# Altium schematic sheet VermogensPrint.SchDoc
size A4; SheetNumber: 1; SheetTotal: 1
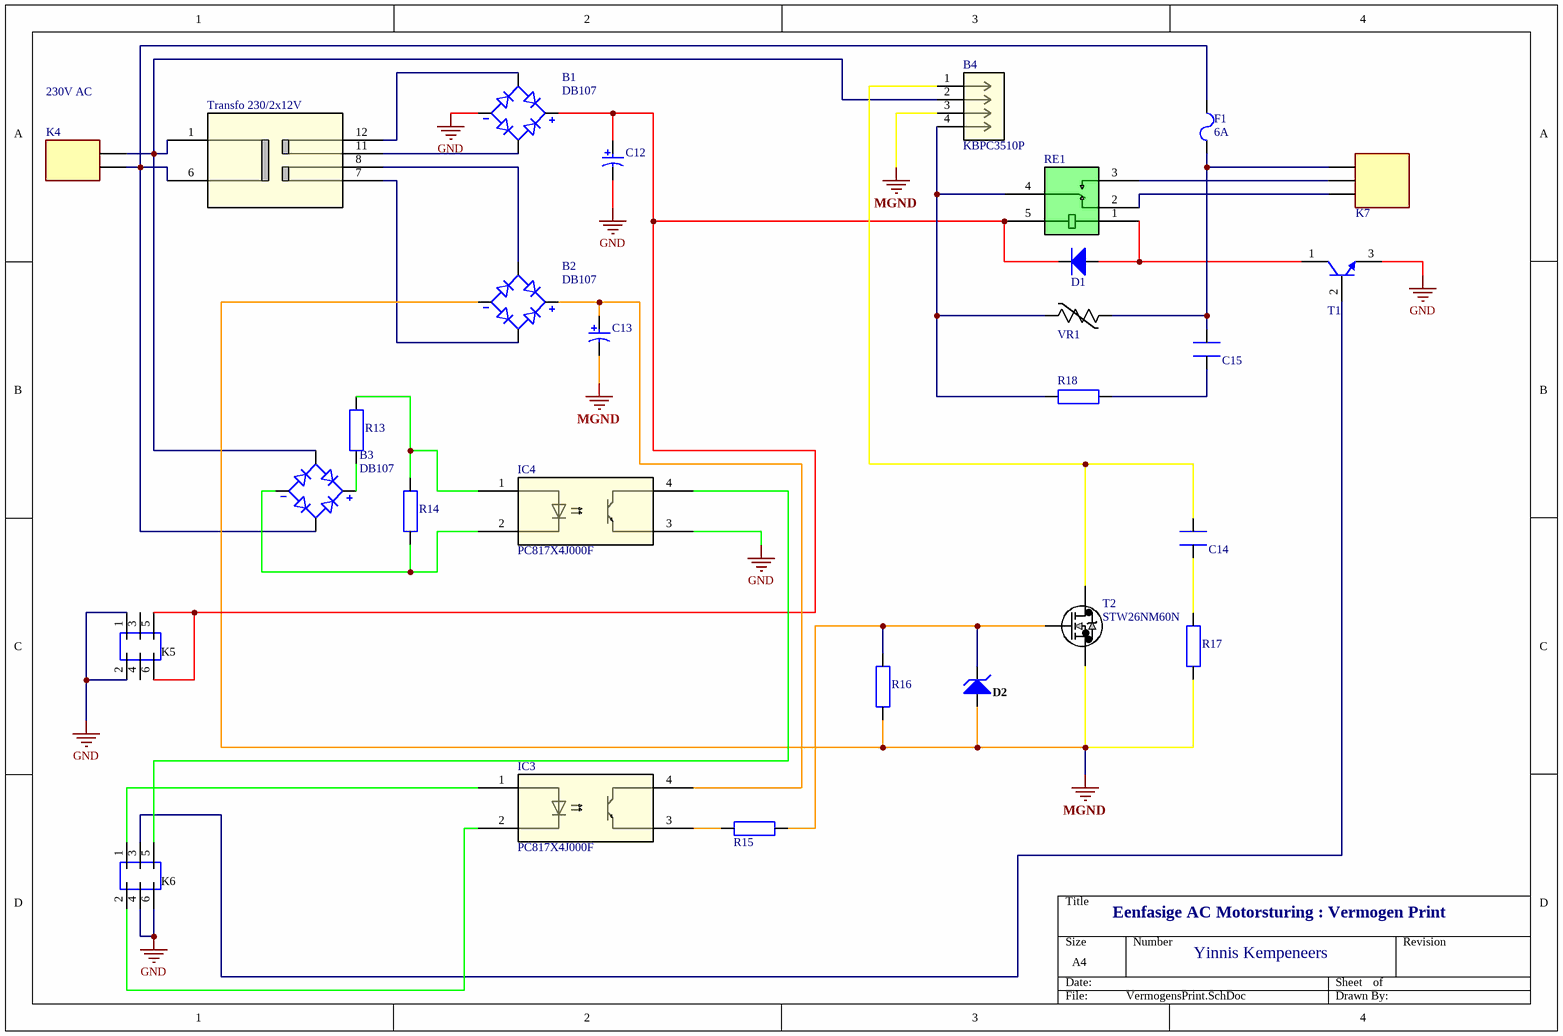
[diagram p0: VermogensPrint.SchDoc]

## Parts
B1  DB107  [DB107]
B2  DB107  [DB107]
B3  DB107  [DB107]
B4  KBPC3510P  [KBPC3510]
C12  470µF  [Capacitor]  (value not drawn)
C13  470µF  [Capacitor]  (value not drawn)
C14  Capacitor 0.22µF 630V  [0.22µF]  (value not drawn)
C15  0.22µF  [0.22µF]  (value not drawn)
D1  1N4007-T  [1N4007-T]  (value not drawn)
D2  1N4742A  [1N4742A]  (value not drawn)
F1  6A  [FUSE]
IC3  PC817X4J000F  [PC817X4J000F]
IC4  PC817X4J000F  [PC817X4J000F]
K4  (no value)  [2-Polige Connector]
K5  TSW-103-08-L-D  [Pin3x2]  (value not drawn)
K6  TSW-103-08-L-D  [Pin3x2]  (value not drawn)
K7  3-Polige Connetor  [3-Polige Connector]  (value not drawn)
R13  47K 3W  [47K 3W]  (value not drawn)
R14  10K 2W  [Resistor]  (value not drawn)
R15  1K  [Resistor]  (value not drawn)
R16  10K  [Resistor]  (value not drawn)
R17  2K2 2W  [2K2 2W]  (value not drawn)
R18  560E 5W  [560Ohm 5W]  (value not drawn)
RE1  G2R-14 DC12  [RELAY_G2R-14_OMR]  (value not drawn)
T1  BC547B  [Transistor]  (value not drawn)
T2  STW26NM60N  [TO-247_STM]
Transfo_230/2x12V  T1  [T1]  (value not drawn)
VR1  V25S275P  [VRES_V25S385P_LTF]  (value not drawn)

## Nets
GND: B1.2(NEG) C12.2 IC4.3 K5.1 K5.2 K6.4 K6.6 T1.3(E)
MGND: B2.2(NEG) B4.3 C13.2 D2.1(A) R16.1 R17.1 T2.3
NetB1_1: B1.1(POS) C12.1 D1.2(K) K5.5 K5.6 RE1.5
NetB1_3: B1.3(AC1) Transfo_230/2x12V.11
NetB1_4: B1.4(AC2) Transfo_230/2x12V.12
NetB2_1: B2.1(POS) C13.1 IC3.4
NetB2_3: B2.3(AC1) Transfo_230/2x12V.7
NetB2_4: B2.4(AC2) Transfo_230/2x12V.8
NetB3_1: B3.1(POS) R13.2
NetB3_2: B3.2(NEG) IC4.2 R14.1
NetB3_3: B3.3(AC1) F1.2 K4.1 Transfo_230/2x12V.6
NetB3_4: B3.4(AC2) B4.2 K4.2 Transfo_230/2x12V.1
NetB4_1: B4.1 C14.1 T2.2
NetB4_4: B4.4 R18.1 RE1.4 VR1.2
NetC14_2: C14.2 R17.2
NetC15_1: C15.1 F1.1 K7.1 VR1.1
NetC15_2: C15.2 R18.2
NetD1_1: D1.1(A) RE1.1 T1.1(C)
NetD2_2: D2.2(K) R15.2 R16.2 T2.1
NetIC3_1: IC3.1 K6.1
NetIC3_2: IC3.2 K6.2
NetIC3_3: IC3.3 R15.1
NetIC4_1: IC4.1 R13.1 R14.2
NetIC4_4: IC4.4 K6.5
NetK6_3: K6.3 T1.2(B)
NetK7_2: K7.2 RE1.3
NetK7_3: K7.3 RE1.2

Not connected (* = marked no-connect by the designer): K5 3 4

## Notes on the sheet
- 230V AC
- Eenfasige AC Motorsturing : Vermogen Print
- Yinnis Kempeneers

## Library data of the parts
B4 = KBPC3510P: No Description Available; Mfr_Name: Solid State Manufacturing; RefDes: RefDes; Type: Type
C12 C13 = 470µF: Capacitor 470µF 50V
C15 = Capacitor 0.22µF 630V
D1 = 1N4007-T: 1.0 A Rectifier, 8 pF, 1000 V, -65 to 150 degC, 2-Pin DO-41 Plastic, RoHS, Tape and Reel; Manufacturer: Diodes Inc; Max. Average Rectified Current IO (A): 1; CT (pF): 8; Max. IR (uA): 5; VRRM (V): 1000; Max. IFSM (A): 30; Mounting Technology: Through Hole; Packing: Tape and Reel; ComponentLink1Description: Manufacturer URL; DatasheetVersion: Rev. 8-2; PackageDescription: 2-Pin Axial Lead, Body 4.635 x 2.36 mm, Lead Spread 25.4 mm; PartNumber: 1N4007-T; ComponentLink2Description: Datasheet; RoHS: TRUE; ComponentLink1URL: http://diodes.com/; ComponentLink2URL: http://diodes.com/datasheets/ds28002.pdf; Operating Temperature Range (degC): -65 to 150; VF (V): 1; PackageReference: DO-41-P-2
D2 = 1N4742A: Zener Diode, 12V, 1W, 5%, -65 to 200 degC, 2-Pin DO-41, Body 2.72 x 5.2 mm, RoHS; Manufacturer: Fairchild Semiconductor; PD (W): 1; VZ (Min.) (V): 11.4; VZ (Max.) (V): 12.6; ZZ (Max) (ohm): 8; IR (uA): 5; Test Current IZ (mA): 21; PartNumber: 1N4742A; PackageVersion: Rev. 2; DatasheetVersion: Rev. H3; Mounting Technology: Through Hole; Tolerance: 5%; PackageDescription: 2-Pin Axial leaded, Body 2.72 x 5.2 mm, Lead Spread 25.4 mm; ComponentLink1Description: Manufacturer URL; ComponentLink3Description: Package Specification; ComponentLink2Description: Datasheet; ComponentLink2URL: http://www.fairchildsemi.com/ds/1N/1N4744A.pdf; PackageReference: DO-41-2; RoHS: TRUE; Operating and Storage Temperature Range: -65 to 200 degC; ComponentLink3URL: http://www.fairchildsemi.com/dwg/DO/DO41A.pdf; ComponentLink1URL: http://www.fairchildsemi.com/
F1 = Fuse: No Description Available; Mfr_Name: Littelfuse Inc
IC3 IC4 = PC817X4J000F: OptoCoupler; Mfr_Name: Sharp; RefDes: RefDes; Type: Type
K4 = 2-Polige Connector: 2~24 Poles, Screw Type, Horizontal, 7.62 Pitch, 26~10 (AWG), Terminal Block Connector; MP: TB005-762-02BE; MF: CUI Devices; SnapEDA_Link: https://www.snapeda.com/parts/TB005-762-02BE/CUI+Devices/view-part/?ref=snap; Price: None; CUI_purchase_URL: https://www.cuidevices.com/product/interconnect/connectors/terminal-blocks/tb005-762-series?utm_source=snapeda.com&utm_medium=referral&utm_campaign=snapedaBOM; Check_prices: https://www.snapeda.com/parts/TB005-762-02BE/CUI+Devices/view-part/?ref=eda; Availability: In Stock; Value: *; Purchase-URL: https://pricing.snapeda.com/search/part/TB005-762-02BE/?ref=eda; Package: None
K5 K6 = Connector3x2: Male Header, Pitch 2.54 mm, 2 x 3 Position,  8.9 x 15.22 x 11.95 mm; Manufacturer: Samtec; DatasheetVersion: 04/2012; ComponentLink3URL: http://suddendocs.samtec.com/prints/tsw-xxx-xx-x-x-xx-xxx-footprint.pdf; PackageReference: TSW-103-08-L-D; Mounting Technology: Through Hole; Min Operating Temperature: -55 degC; ComponentLink2Description: Datasheet; Lead Pitch: 2.54 mm; ComponentLink1Description: Manufacturer URL; Mount: Through Hole; ComponentLink1URL: http://www.samtec.com/; ComponentLink3Description: Package Specification; Max Operating Temperature: 125 degC; PackageDescription: Male Header, Pitch 2.54 mm, 2 x 3 Position, Height 8.38 mm, Tail Length 5.08 mm; ComponentLink2URL: https://datasheet.ciiva.com/25618/0900766b81154476-25618436.pdf; RoHSCompliant: true
K7 = 3-Polige Connetor: MP: TB005-762-03BE; Package: None; Availability: Unavailable; Price: None
R14-R16 = Resistor 250mW
R18 = 560ohm5W: Resistor, 560 Ohm, ± 5%, 5 W, Axial Leaded, Wirewound, General Purpose; NexarPartId: 39746692; Lead Diameter: 800µm; Voltage Rating: 53V; Temperature Coefficient: -80ppm/°C; Resistance: 560Ω; Max Power Dissipation: 5W; Length: 18mm; Tolerance: 5%; Contact Plating: Tin; Composition: Wirewound; Width: 7.49mm; Features: Flame Retardant Coating; Min Operating Temperature: -40°C; Number of Terminations: 2; Number of Pins: 2; Radiation Hardening: No; Military Standard: Not; Schedule B: 8533210080, 8533210080|8533210080|8533210080|8533210080|8533210080; Power Rating: 5W; Case/Package: Axial; RoHS: Compliant; REACH SVHC: Unknown; Packaging: Tape & Box (TB); Termination: Axial; Voltage Rating (DC): 53V; Max Operating Temperature: 275°C; Diameter: 7.5mm
RE1 = G2R-14 DC12: No Description Available; Mfr_Name: Omron; Type: Type; RefDes: RefDes
T1 = BC547B: Amplifier Transistor, NPN Silicon, 3-Pin TO-92, Bulk Box; Manufacturer: On Semiconductor; IC Continuous (A): 0.1; fT Min (MHz): 150; DatasheetVersion: Rev. 7; ComponentLink1URL: http://www.onsemi.com/; Polarity: NPN; RoHS: FALSE; ComponentLink1Description: Manufacturer URL; Packing: Bulk Box; PackageDescription: 3-Pin Transistor Outline, Body 4.825 x 3.685 mm, Pitch 1.27 mm; ComponentLink3URL: http://www.onsemi.cn/pub_link/Collateral/2N6426-D.PDF; ComponentLink2Description: Datasheet; PackageVersion: Rev. AM; PackageReference: TO-92-3-29-11_AM_SL; ComponentLink3Description: Package Specification; Mounting Technology: Through Hole; PartNumber: BC547B; ComponentLink2URL: http://www.onsemi.com/pub_link/Collateral/BC546-D.PDF
T2 = STW26NM60N: No Description Available; Mfr_Name: STMicroelectronics
Transfo_230/2x12V = T1: No Description Available; Mfr_Name: Myrra; RefDes: RefDes; Type: Type
VR1 = V25S385P: No Description Available; Mfr_Name: Littelfuse Inc
B1-B3 = DB107: Package: None; Availability: Unavailable; Value: *; MP: DB107; Price: None